# EAGLE design OneShot_Relais_Timer (EAGLE 9.6.2)
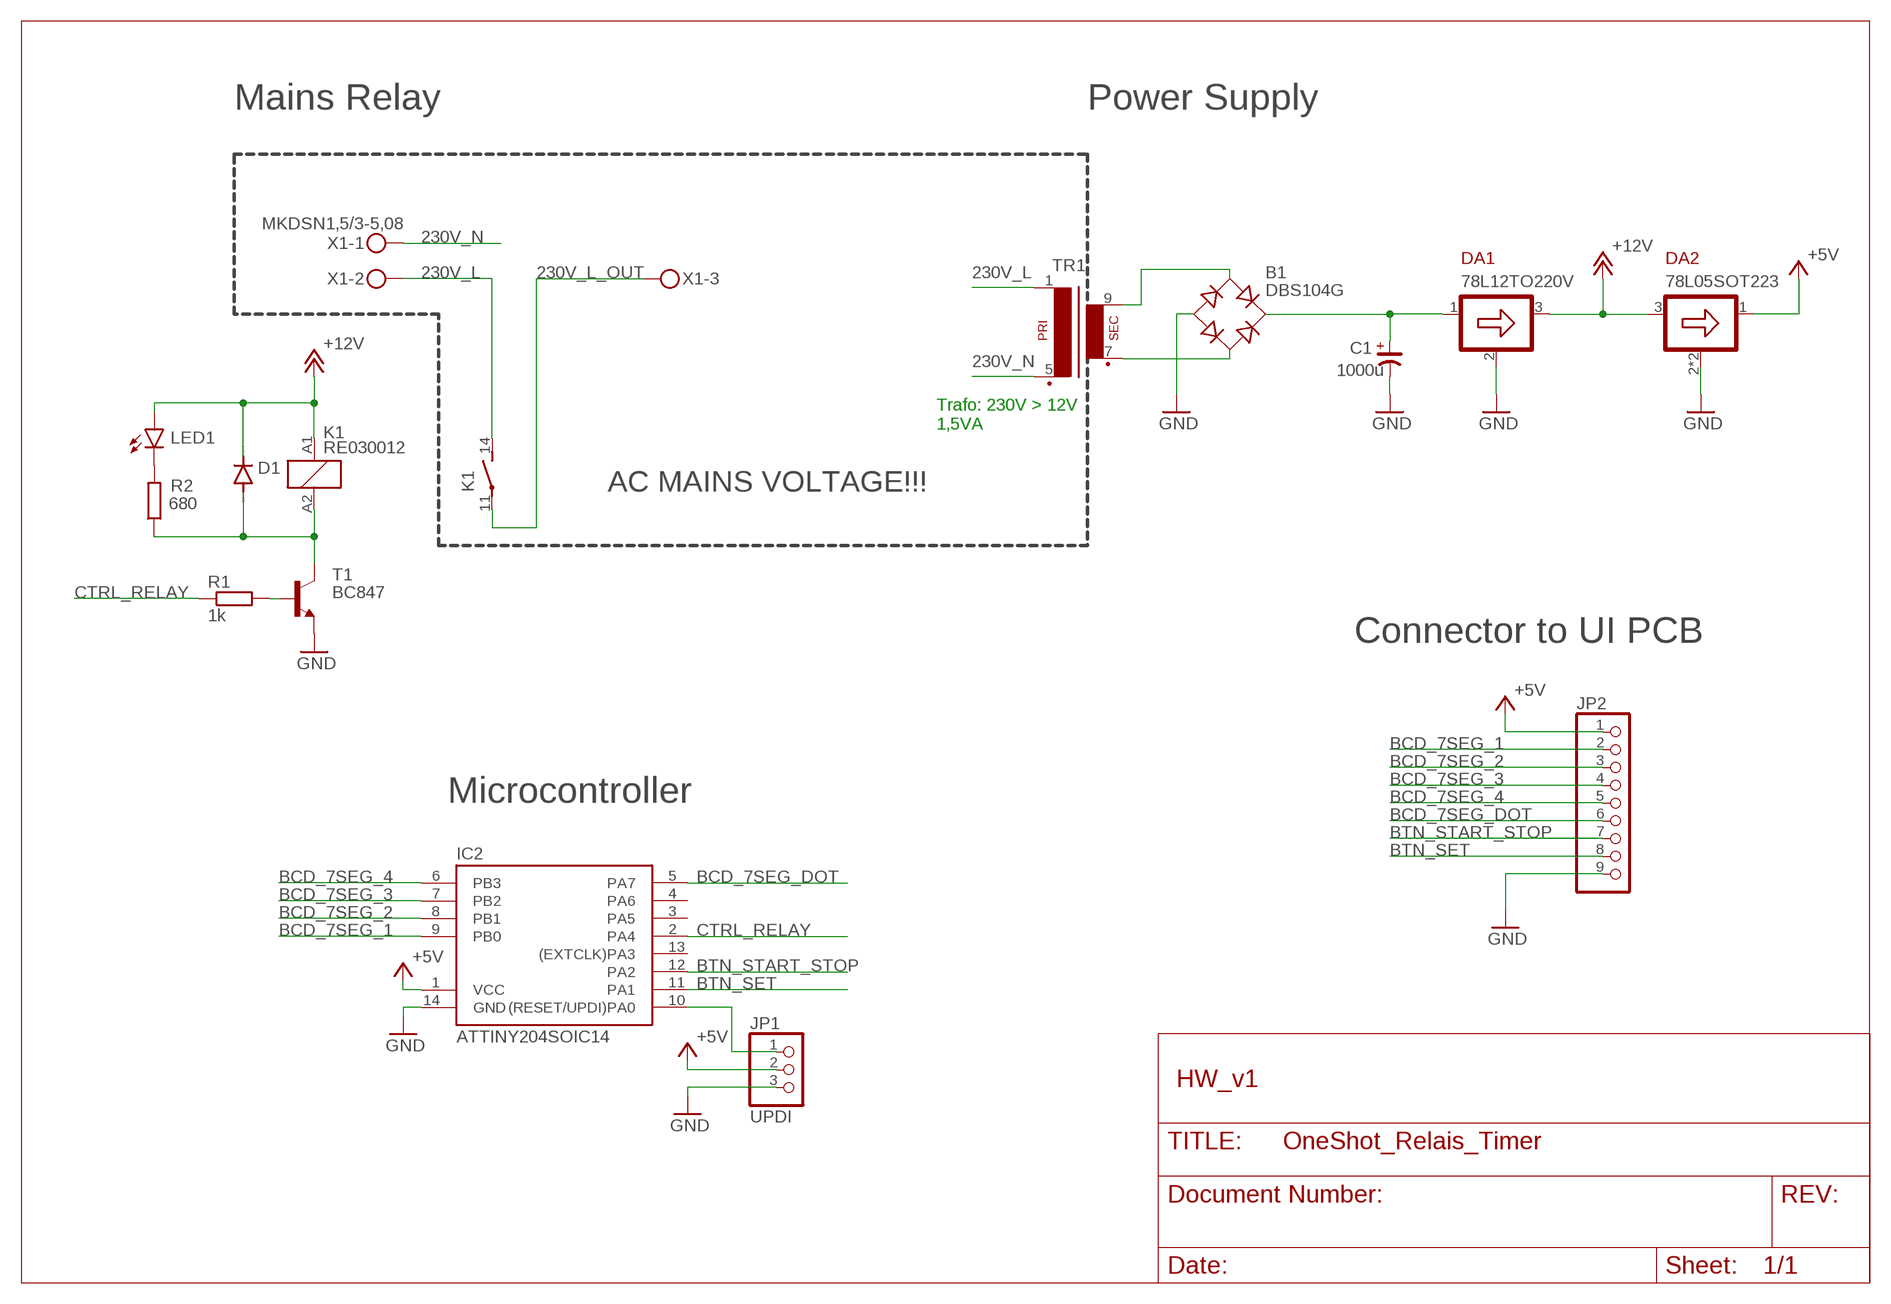
[diagram p0: schematic, sheet 1]

## Parts
B1  DBS104G  [DBS]
C1  1000u  CP_  [CSV-G]
D1  DIODE-SOD80C  [SOD80C]
DA1  78L12TO220V  [TO220V]
DA2  78L05SOT223  [SOT223]
IC2  ATTINY204SOIC14  [SOIC127P600X175-14N]
JP1  UPDI  PINHD-1X3  [1X03]
JP2  PINHD-1X9  [1X09]
K1  RE030012  [RE-SCHRACK]
LED1  LED5MM  [LED5MM]
R1  1k  R-EU_R0805  [R0805]
R2  680  R-EU_R0805  [R0805]
T1  BC847  [SOT23]
TR1  EI30-12.5  [EI30-1]
X1  MKDSN1,5/3-5,08  [MKDSN1,5/3-5,08]

## Nets
230V_L [AC_Mains]: K1.14(2:S) TR1.1 X1.2
230V_L_OUT [AC_Mains]: K1.11(2:P) X1.3
230V_N [AC_Mains]: TR1.5(P2) X1.1
+5V: DA2.1(OUT) IC2.1(VCC) JP1.2 JP2.1
+12V: D1.C DA1.3(OUT) DA2.3(IN) K1.A1 LED1.A
BCD_7SEG_1: IC2.9(PB0) JP2.2
BCD_7SEG_2: IC2.8(PB1) JP2.3
BCD_7SEG_3: IC2.7(PB2) JP2.4
BCD_7SEG_4: IC2.6(PB3) JP2.5
BCD_7SEG_DOT: IC2.5(PA7) JP2.6
BTN_SET: IC2.11(PA1) JP2.8
BTN_START_STOP: IC2.12(PA2) JP2.7
CTRL_RELAY: IC2.2(PA4) R1.1
GND: B1.- C1.- DA1.2(GND) DA2.2(GND) DA2.4(GND) IC2.14(GND) JP1.3 JP2.9 T1.2(E)
N$1: R1.2 T1.1(B)
N$2: LED1.K(C) R2.2
N$3: D1.A K1.A2 R2.1 T1.3(C)
N$21: B1.+ C1.+ DA1.1(IN)
N$22: B1.AC2 TR1.7(S3)
N$23: B1.AC1 TR1.9(S4)
N$26: IC2.10((RESET/UPDI)PA0) JP1.1
Unconnected: IC2.3(PA5) IC2.4(PA6) IC2.13((EXTCLK)PA3)

## Notes on the sheet
- Mains Relay | Power Supply
- Trafo: 230V > 12V
  1,5VA
- AC MAINS VOLTAGE!!!
- Connector to UI PCB
- Microcontroller
- HW_v1

## Library data of the parts
B1 = rectifier:DB?*G: Single Phase 1.0 AMP Glass Passivated Bridge Rectifier Taiwan Semiconductor Co.,Ltd. - TSC Source: http://www.taiwansemi.com/TSCbig5/ezcatfiles/cust/img/img/db101g.pdf http://www.ts.com.tw/db/pictures/modules/PDT/PDT060207001/DBLS201G.pdf
C1 = OwnDevices:CP_
D1 = diode:DIODE-: DIODE
DA1 = regulators-linear:78L12
DA2 = regulators-linear:78L05
IC2 = OwnDevices:ATTINY204: MICROCONTROLLER 2 Kbytes ROM
JP1 = pinhead:PINHD-1X3: PIN HEADER
JP2 = pinhead:PINHD-1X9: PIN HEADER
K1 = OwnDevices:RE03*: Miniature PCB Relay 1 pole 6 A SCHRACK Source: http://www.schrack.com/.. 5812.pdf; MF: TYCO ELECTRONICS; MPN: RE030012; OC_FARNELL: 515840; OC_NEWARK: 17M1743
LED1 = led:LED: LED OSRAM: - CHIPLED LG R971, LG N971, LY N971, LG Q971, LY Q971, LO R971, LY R971 LH N974, LH R974 LS Q976, LO Q976, LY Q976 LO Q996 - Hyper CHIPLED LW Q18S LB Q993, LB Q99A, LB R99A - SideLED LS A670, LO A670, LY A670, LG A670, LP A670 LB A673, LV A673, LT A673, LW A673 LH A674 LY A675 LS A676, LA A676, LO A676, LY A676, LW A676 LS A679, LY A679, LG A679 - Hyper Micro SIDELED® LS Y876, LA Y876, LO Y876, LY Y876 LT Y87S - SmartLED LW L88C, LW L88S LB L89C, LB L89S, LG L890 LS L89K, LO L89K, LY L89K LS L896, LA L896, LO L896, LY L896 - TOPLED LS T670, LO T670, LY T670, LG T670, LP T670 LSG T670, LSP T670, LSY T670, LOP T670, LYG T670 LG T671, LOG T671, LSG T671 LB T673, LV T673, LT T673, LW T673 LH T674 LS T676, LA T676, LO T676, LY T676, LB T676, LH T676, LSB T676, LW T676 LB T67C, LV T67C, LT T67C, LS T67K, LO T67K, LY T67K, LW E67C LS E67B, LA E67B, LO E67B, LY E67B, LB E67C, LV E67C, LT E67C LW T67C LS T679, LY T679, LG T679 LS T770, LO T770, LY T770, LG T770, LP T770 LB T773, LV T773, LT T773, LW T773 LH T774 LS E675, LA E675, LY E675, LS T675 LS T776, LA T776, LO T776, LY T776, LB T776 LHGB T686 LT T68C, LB T68C - Hyper Mini TOPLED® LB M676 - Mini TOPLED Santana® LG M470 LS M47K, LO M47K, LY M47K Source: http://www.osram.convergy.de LUXEON: - LUMILED® LXK2-PW12-R00, LXK2-PW12-S00, LXK2-PW14-U00, LXK2-PW14-V00 LXK2-PM12-R00, LXK2-PM12-S00, LXK2-PM14-U00 LXK2-PE12-Q00, LXK2-PE12-R00, LXK2-PE12-S00, LXK2-PE14-T00, LXK2-PE14-U00 LXK2-PB12-K00, LXK2-PB12-L00, LXK2-PB12-M00, LXK2-PB14-N00, LXK2-PB14-P00, LXK2-PB14-Q00 LXK2-PR12-L00, LXK2-PR12-M00, LXK2-PR14-Q00, LXK2-PR14-R00 LXK2-PD12-Q00, LXK2-PD12-R00, LXK2-PD12-S00 LXK2-PH12-R00, LXK2-PH12-S00 LXK2-PL12-P00, LXK2-PL12-Q00, LXK2-PL12-R00 Source: www.luxeon.com KINGBRIGHT: KA-3528ASYC Source: www.kingbright.com
R1 R2 = OwnDevices:R-EU_: RESISTOR, European symbol; SPICEPREFIX: R
T1 = transistor:BC847: NPN TRANSISTOR
TR1 = OwnDevices:EI30-12.5: TRANSFORMER 1 primary winding, 1 secondary winding ERA
X1 = OwnDevices:MKDSN1,5/3-5,08: MKDSN 1,5/ 3-5,08 Printklemme Nennstrom: 13,5 A Nennspannung: 250 V Rastermaß: 5,08 mm Polzahl: 3 Anschlussart: Schraubanschluss Montage: Löten Anschlussrichtung Leiter/Platine: 0 ° Artikelnummer: 1729131 Source: http://eshop.phoenixcontact.com .. 1729131.pdf

## Board
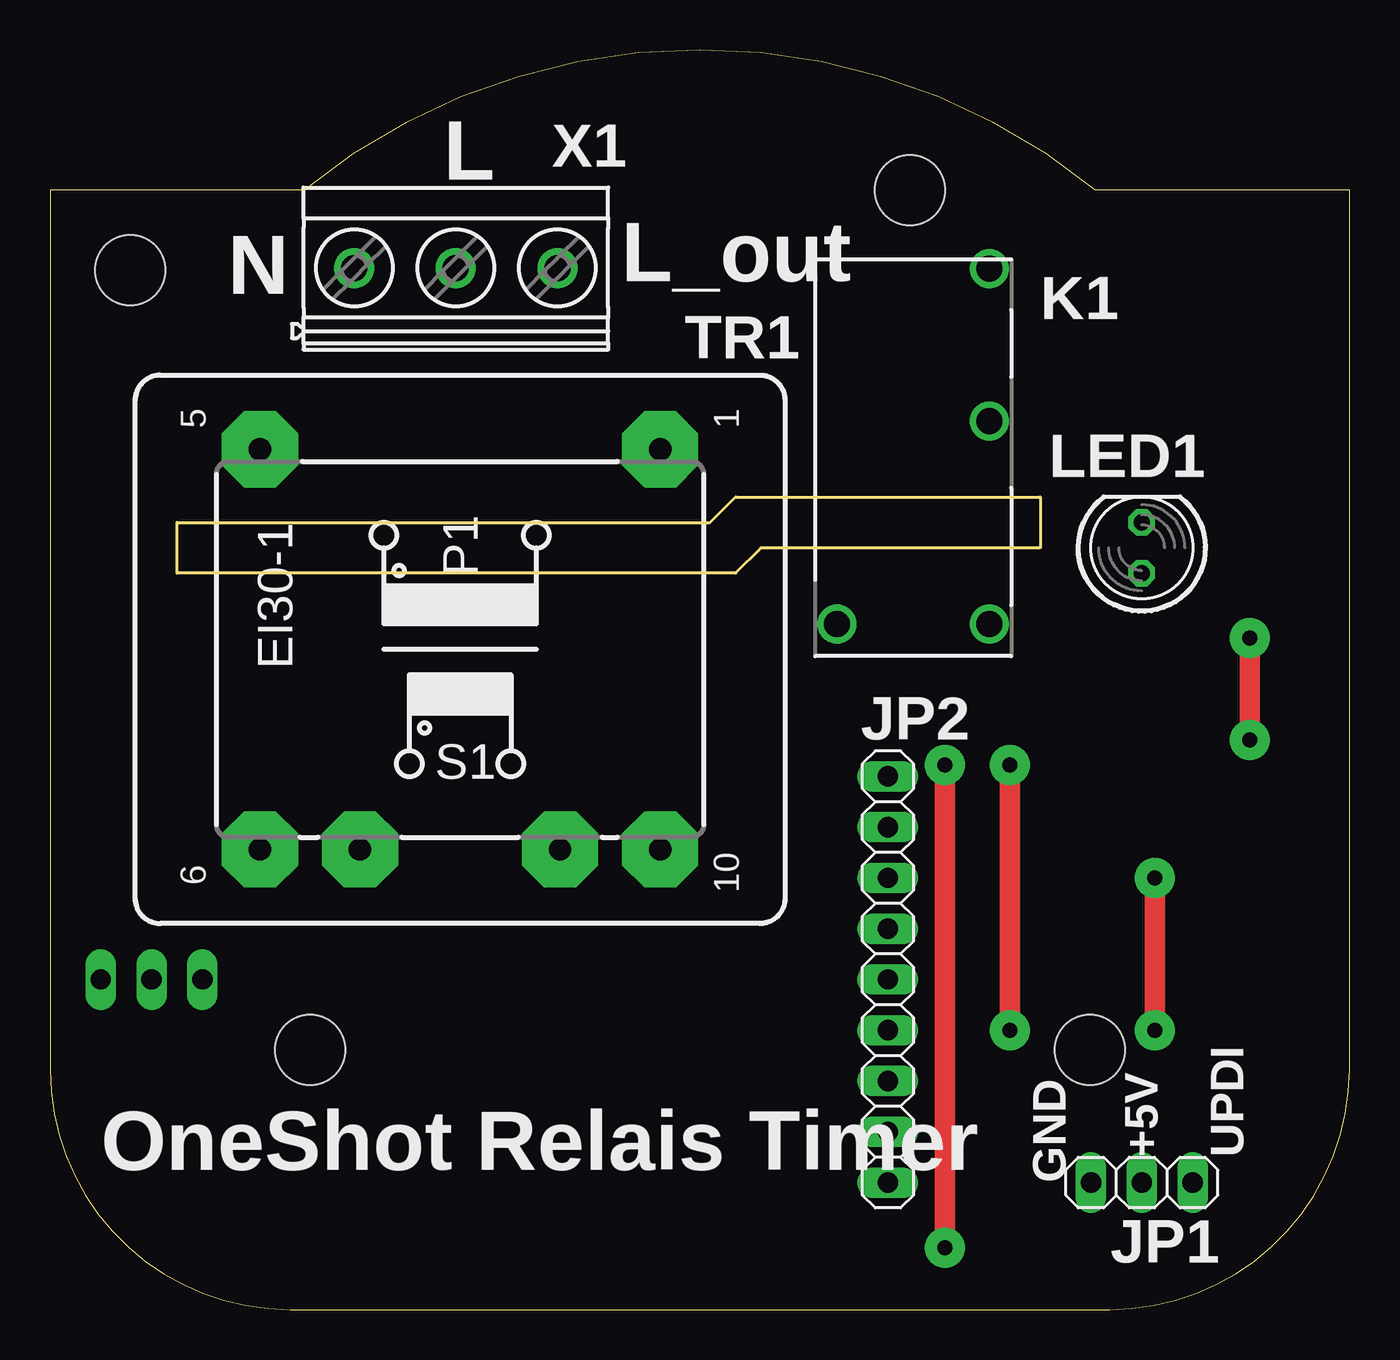
[diagram p1: board, top side]
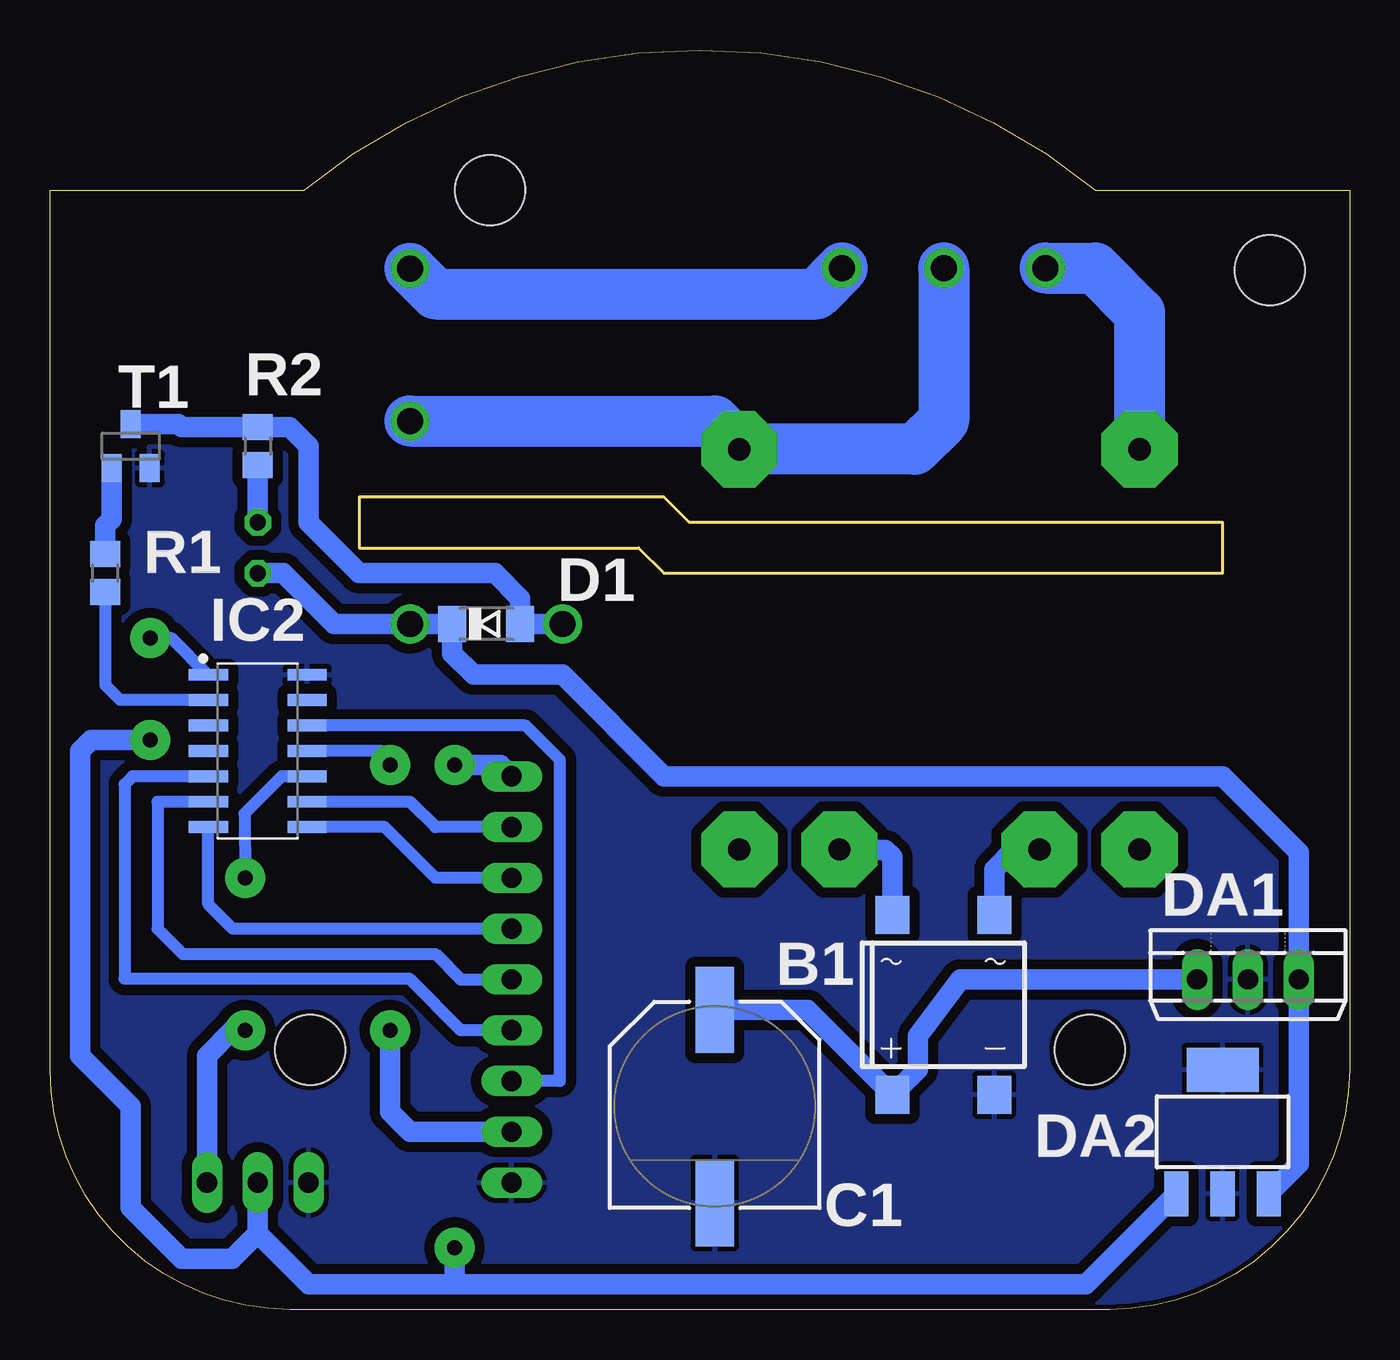
[diagram p2: board, bottom side, seen from below]

Size 65 x 63 mm. Coordinates in mm from the lower left corner, seen from the top.
Outline: 0,56 0,12 arc90 12,0 53,0 arc90 65,12 65,56 52.3,56 arc78 12.7,56 0,56
Outline: 6.35,39.37 33.02,39.37 34.29,40.64 49.53,40.64 49.53,38.1 35.56,38.1 34.29,36.83 6.35,36.83 6.35,39.37
Copper layers (1*16): Top 0.035mm / dielectric 1.5mm / Bottom 0.035mm
Design rules "ownDesignRules": minimum track width 15mil, minimum drill 0.5mm, track to track 20mil, track to pad 20mil, pad to pad 6mil, via to via 6mil, smd to smd 6mil, copper to edge 10mil, drill to drill 6mil, minimum pad ring 10mil, minimum via ring 8mil, stop-mask expansion 4mil, vias tented up to drill 0mil, thermal gap 10mil
Holes 3.5 mm at 13,13 52,13 43,56 4,52

### Footprints (pad centres in the part's own frame; a part is rotated, then mirrored left to right if it is on the bottom)
DBS = smd 1.7 x 1.9: + -2.55,-4.5; - 2.55,-4.5; AC1 -2.55,4.5; AC2 2.55,4.5
CSV-G = smd 4.318 x 1.93: + -4.826,0; - 4.826,0
SOD80C = smd 1.4 x 1.8: A 1.7,0; C -1.7,0
TO220V = drill 1.016 long: 1 -2.54,-2.54; 2 0,-2.54; 3 2.54,-2.54
SOT223 = smd 1.219 x 2.235: 1 -2.311,-3.099; 2 0,-3.099; 3 2.311,-3.099 | smd 3.6 x 2.2: 4 0,3.099
SOIC127P600X175-14N = smd 1.968 x 0.599: 1 -2.473,3.81; 2 -2.473,2.54; 3 -2.473,1.27; 4 -2.473,0; 5 -2.473,-1.27; 6 -2.473,-2.54; 7 -2.473,-3.81; 8 2.473,-3.81; 9 2.473,-2.54; 10 2.473,-1.27; 11 2.473,0; 12 2.473,1.27; 13 2.473,2.54; 14 2.473,3.81
1X03 = drill 1.016 long: 1 -2.54,0; 2 0,0; 3 2.54,0
1X09 = drill 1.016 long: 1 -10.16,0; 2 -7.62,0; 3 -5.08,0; 4 -2.54,0; 5 0,0; 6 2.54,0; 7 5.08,0; 8 7.62,0; 9 10.16,0
RE-SCHRACK = drill 1.3: 11 8.89,-3.81; 14 1.27,-3.81; A1 -8.89,-3.81; A2 -8.89,3.81
LED5MM = drill 0.813 octagon: A -1.27,0; K 1.27,0
R0805 = smd 1.3 x 1.5: 1 -0.95,0; 2 0.95,0
SOT23 = smd 1 x 1.4: 1 -0.95,-1.1; 2 0.95,-1.1; 3 0,1.1
EI30-1 = drill 1.118 pad 3.81 octagon: 1 -10.008,10.008; 5 -10.008,-10.008; 6 10.008,-10.008; 7 10.008,-5.004; 9 10.008,5.004; 10 10.008,10.008
MKDSN1,5/3-5,08 = drill 1.3 pad 2: 1 -7.641,0.025; 2 -2.561,0.025; 3 2.519,0.025

### Placement (x,y rotation side)
B1  20.32,15.24 0 bottom
C1  31.75,10.16 270 bottom
D1  43.18,34.29 0 bottom
DA1  5.08,19.05 0 bottom
DA2  6.35,8.89 0 bottom
IC2  54.61,27.94 0 bottom
JP1  54.61,6.35 180 top
JP2  41.91,16.51 270 top
K1  43.18,43.18 90 top
LED1  54.61,38.1 90 top
R1  62.23,36.83 90 bottom
R2  54.61,43.18 270 bottom
T1  60.96,43.18 0 bottom
TR1  20.51,33.02 270 top
X1  22.86,52.07 0 top

### Tracks (layer width: path | path; a pad name or v marks a point on that pad's centre or on a via)
230V_L
  Bottom 2.54: X1.2 20.3,44.47 21.74,43.03 TR1.1 30.52,43.22 31.75,44.45 K1.14
230V_L_OUT
  Bottom 2.54: K1.11 45.72,50.8 26.67,50.8 X1.3
230V_N
  Bottom 2.54: TR1.5 10.5,49.87 12.72,52.09 X1.1
+5V  (via drill 0.75 pad 2)
  Top 1.016: v60,28.5 v60,33.58 | v44.76,27.25 v44.76,3.1
  Bottom 0.61: IC2.1 58.91,33.58 v60,33.58
  Bottom 1.016: DA2.1 13.18,1.27 44.45,1.27 | 44.45,1.27 52.07,1.27 54.61,3.81 | 54.61,3.81 JP1.2 | 54.61,3.81 55.88,2.54 58.42,2.54 60.96,5.08 60.96,10.16 63.5,12.7 63.5,27.94 62.94,28.5 v60,28.5 | JP2.1 42.47,27.23 v44.76,27.25 | v44.76,3.1 44.76,1.58 44.45,1.27
+12V
  Bottom 1.016: DA2.3 2.54,7.29 DA1.3 2.54,22.86 6.35,26.67 34.29,26.67 39.37,31.75 43.81,31.75 44.88,32.82 D1.C K1.A1 50.8,34.29 53.34,36.83 LED1.A
BCD_7SEG_1
  Bottom 0.61: JP2.2 45.72,24.13 46.99,25.4 IC2.9
BCD_7SEG_2
  Bottom 0.61: JP2.3 45.72,21.59 48.26,24.13 IC2.8
BCD_7SEG_3
  Bottom 0.61: IC2.7 57.08,20.27 55.86,19.05 JP2.4
BCD_7SEG_4
  Bottom 0.61: IC2.6 59.62,25.4 59.62,19.05 58.35,17.78 45.72,17.78 44.45,16.51 JP2.5
BCD_7SEG_DOT
  Bottom 0.61: JP2.6 44.45,13.97 47.02,16.54 61.27,16.54 61.27,26.27 60.87,26.67 IC2.5
BTN_SET  (via drill 0.75 pad 2)
  Top 1.016: v48,13.97 v48,27.25
  Bottom 0.61: v48,27.25 48.44,27.94 IC2.11
  Bottom 1.016: v48,13.97 48,9.9 46.99,8.89 JP2.8
BTN_START_STOP
  Bottom 0.61: JP2.7 39.5,11.43 39.5,27.5 41.21,29.21 IC2.12
CTRL_RELAY
  Bottom 0.61: R1.1 62.23,31.23 61.5,30.5 57.1,30.5 IC2.2
GND
  Bottom 0.381: 6.46,6 DA2.2 | DA2.4 6.46,11.88
  pour Bottom: 0,0 66.04,0 66.04,58.42 49.53,58.42 49.53,38.1 36.83,38.1 36.83,30.48 0,30.48
N$1
  Bottom 1.016: R1.2 62.23,39.22 61.91,39.54 T1.1
N$2
  Bottom 1.016: LED1.K R2.2
N$3
  Bottom 1.016: K1.A2 D1.A 41.48,35.56 42.75,36.83 49.53,36.83 52.07,39.37 52.07,43.18 53.02,44.13 R2.1 58.42,44.13 58.57,44.28 T1.3
N$21
  Bottom 1.016: C1.+ 27.12,14.99 B1.+ 21.6,12.01 21.6,13.69 19.47,16.51 DA1.1
N$22
  Bottom 1.016: B1.AC2 17.77,22.02 16.78,23.01 TR1.7
N$23
  Bottom 0.381: TR1.9
  Bottom 1.016: TR1.9 23.23,23 22.87,22.64 B1.AC1
N$26  (via drill 0.75 pad 2)
  Top 1.016: v55.25,13.97 v55.25,21.59
  Bottom 0.61: IC2.10 53.41,26.67 55.27,24.81 v55.25,21.59
  Bottom 1.016: JP1.1 57.15,12.7 55.88,13.97 v55.25,13.97

### Text on the board
tNames: L | N | L_out | +5V | UPDI | OneShot Relais Timer | GND